# EAGLE schematic LTC2 Top-level Schematic (EAGLE 6.5.0)
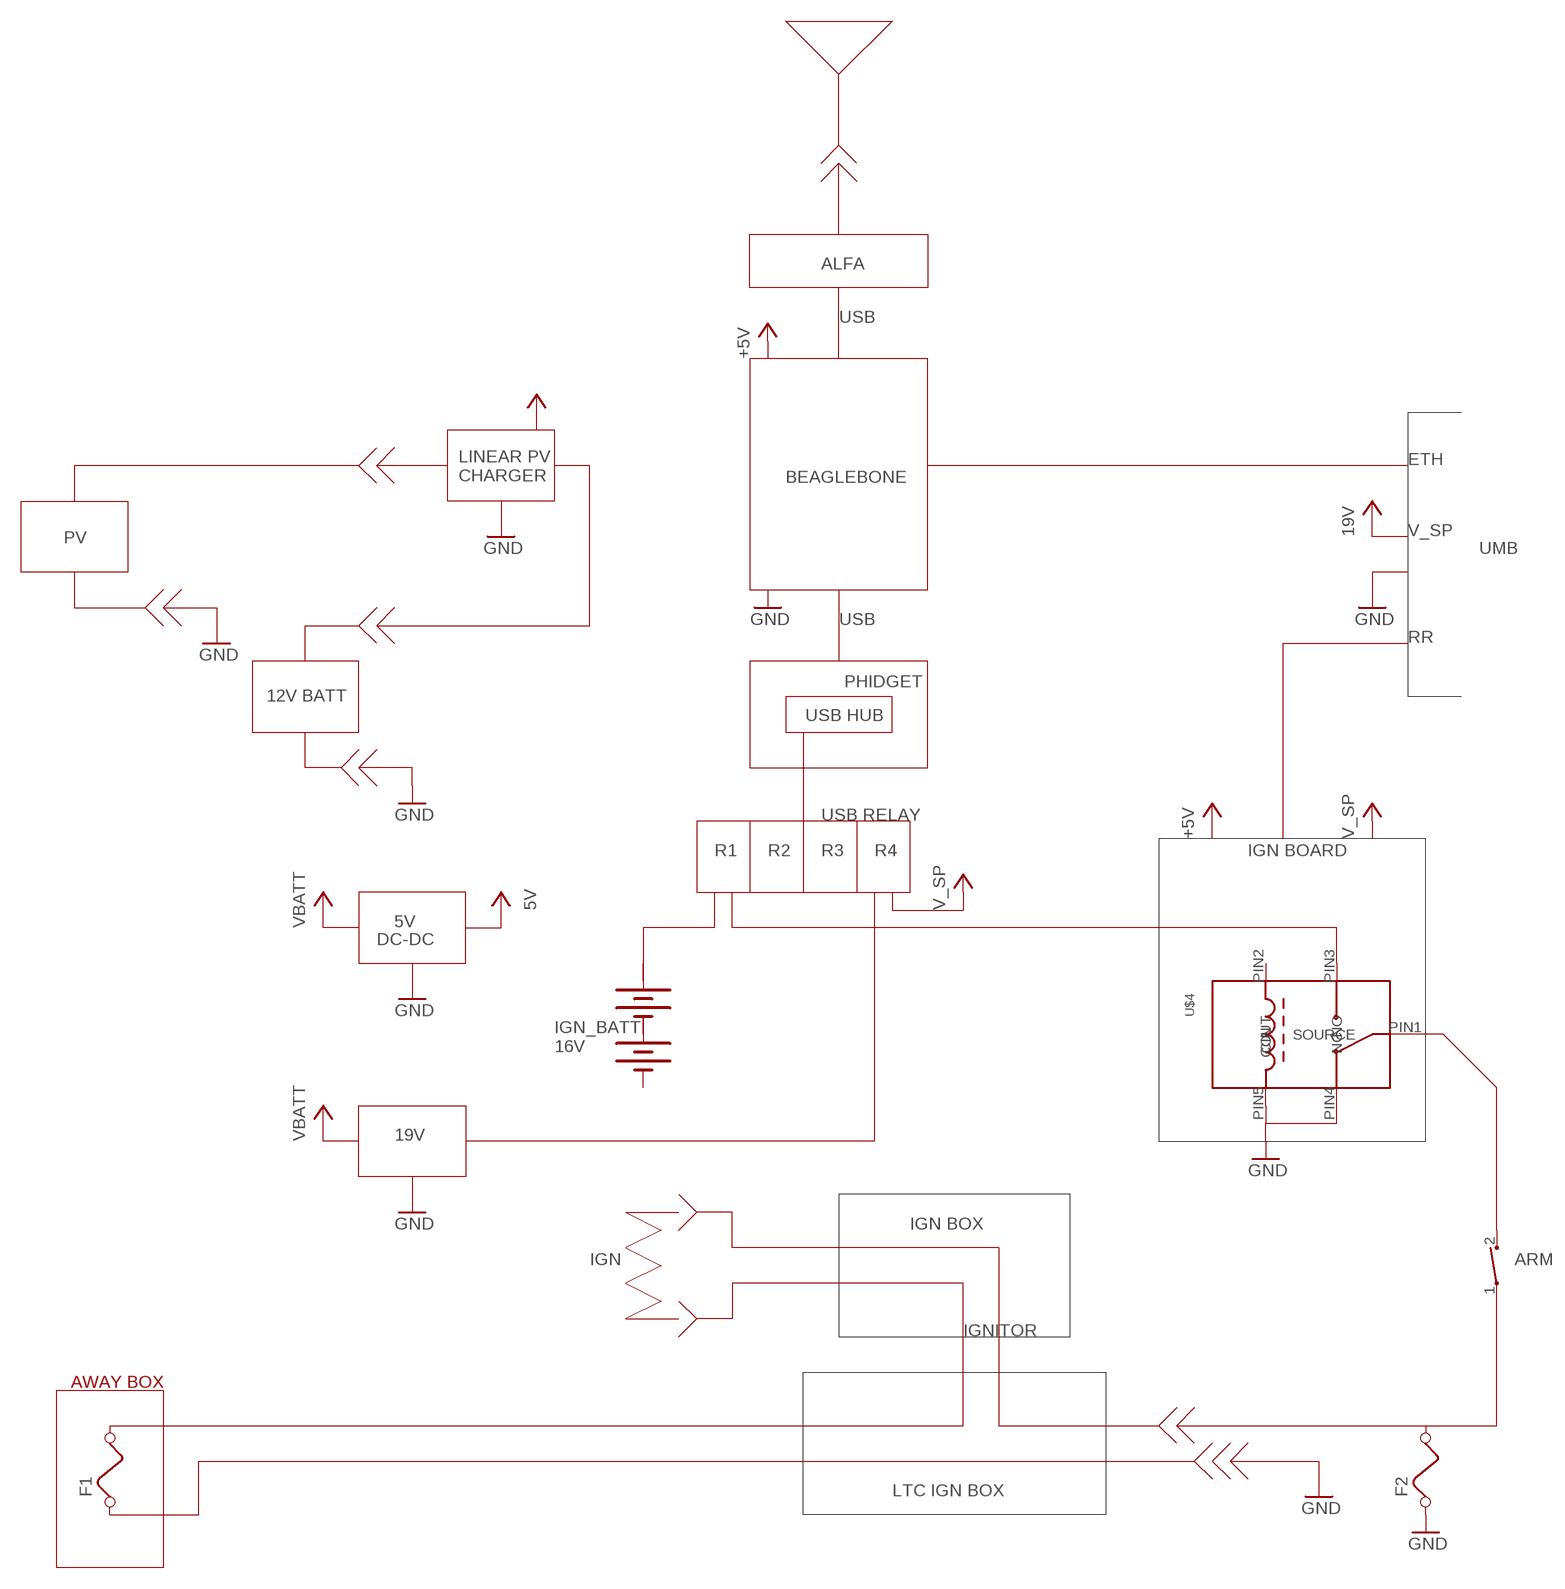
[diagram p0: schematic, sheet 1]

## Parts
ARM  CT10-XXXX-A2  [CT10-XXXX-A2]
BAT1  BATTERY  [BATTERY]
BAT2  BATTERY  [BATTERY]
F1  FUSE  [FUSE]
F2  FUSE  [FUSE]
U$4  RELAY-2  [G5LA]

## Nets
GND: F2.1
N$1: BAT1.- BAT2.+@1(+)
Unconnected: ARM.1 ARM.2 F1.1 F1.2 F2.2 U$4.PIN1(SOURCE) U$4.PIN2(COUT) U$4.PIN3(NO) U$4.PIN4(NC) U$4.PIN5(CIN)

## Notes on the sheet
- ALFA
- USB
- ETH
- LINEAR PV
  CHARGER
- BEAGLEBONE
- 19V | V_SP
- PV
- UMB
- USB
- RR
- PHIDGET
- 12V BATT
- USB HUB
- USB RELAY
- V_SP
- R1 | R2 | R3 | R4 | IGN BOARD
- 5V | V_SP
- VBATT | 5V
- DC-DC
- IGN_BATT
  16V
- VBATT | 19V
- IGN BOX
- IGN | ARM
- IGNITOR
- AWAY BOX
- LTC IGN BOX

## Power pins joined to a net without a drawn wire
+: BAT1.+ BAT1.+@1(+) BAT2.+
-: BAT2.-

## Library data of the parts
ARM = switch-coto:CT10-XXXX-: CT10 Series Molded Switch Source: www.cotorelay.com .. Coto_Technology__CT10-1530-G1.pdf
BAT1 BAT2 = special:BATTERY: BATTERY
F1 F2 = special:FUSE: FUSE 5 x 20 mm
U$4 = launch-tower:RELAY-2